# EAGLE design BLE112 Breakout Board v1.1 (EAGLE 6.1)
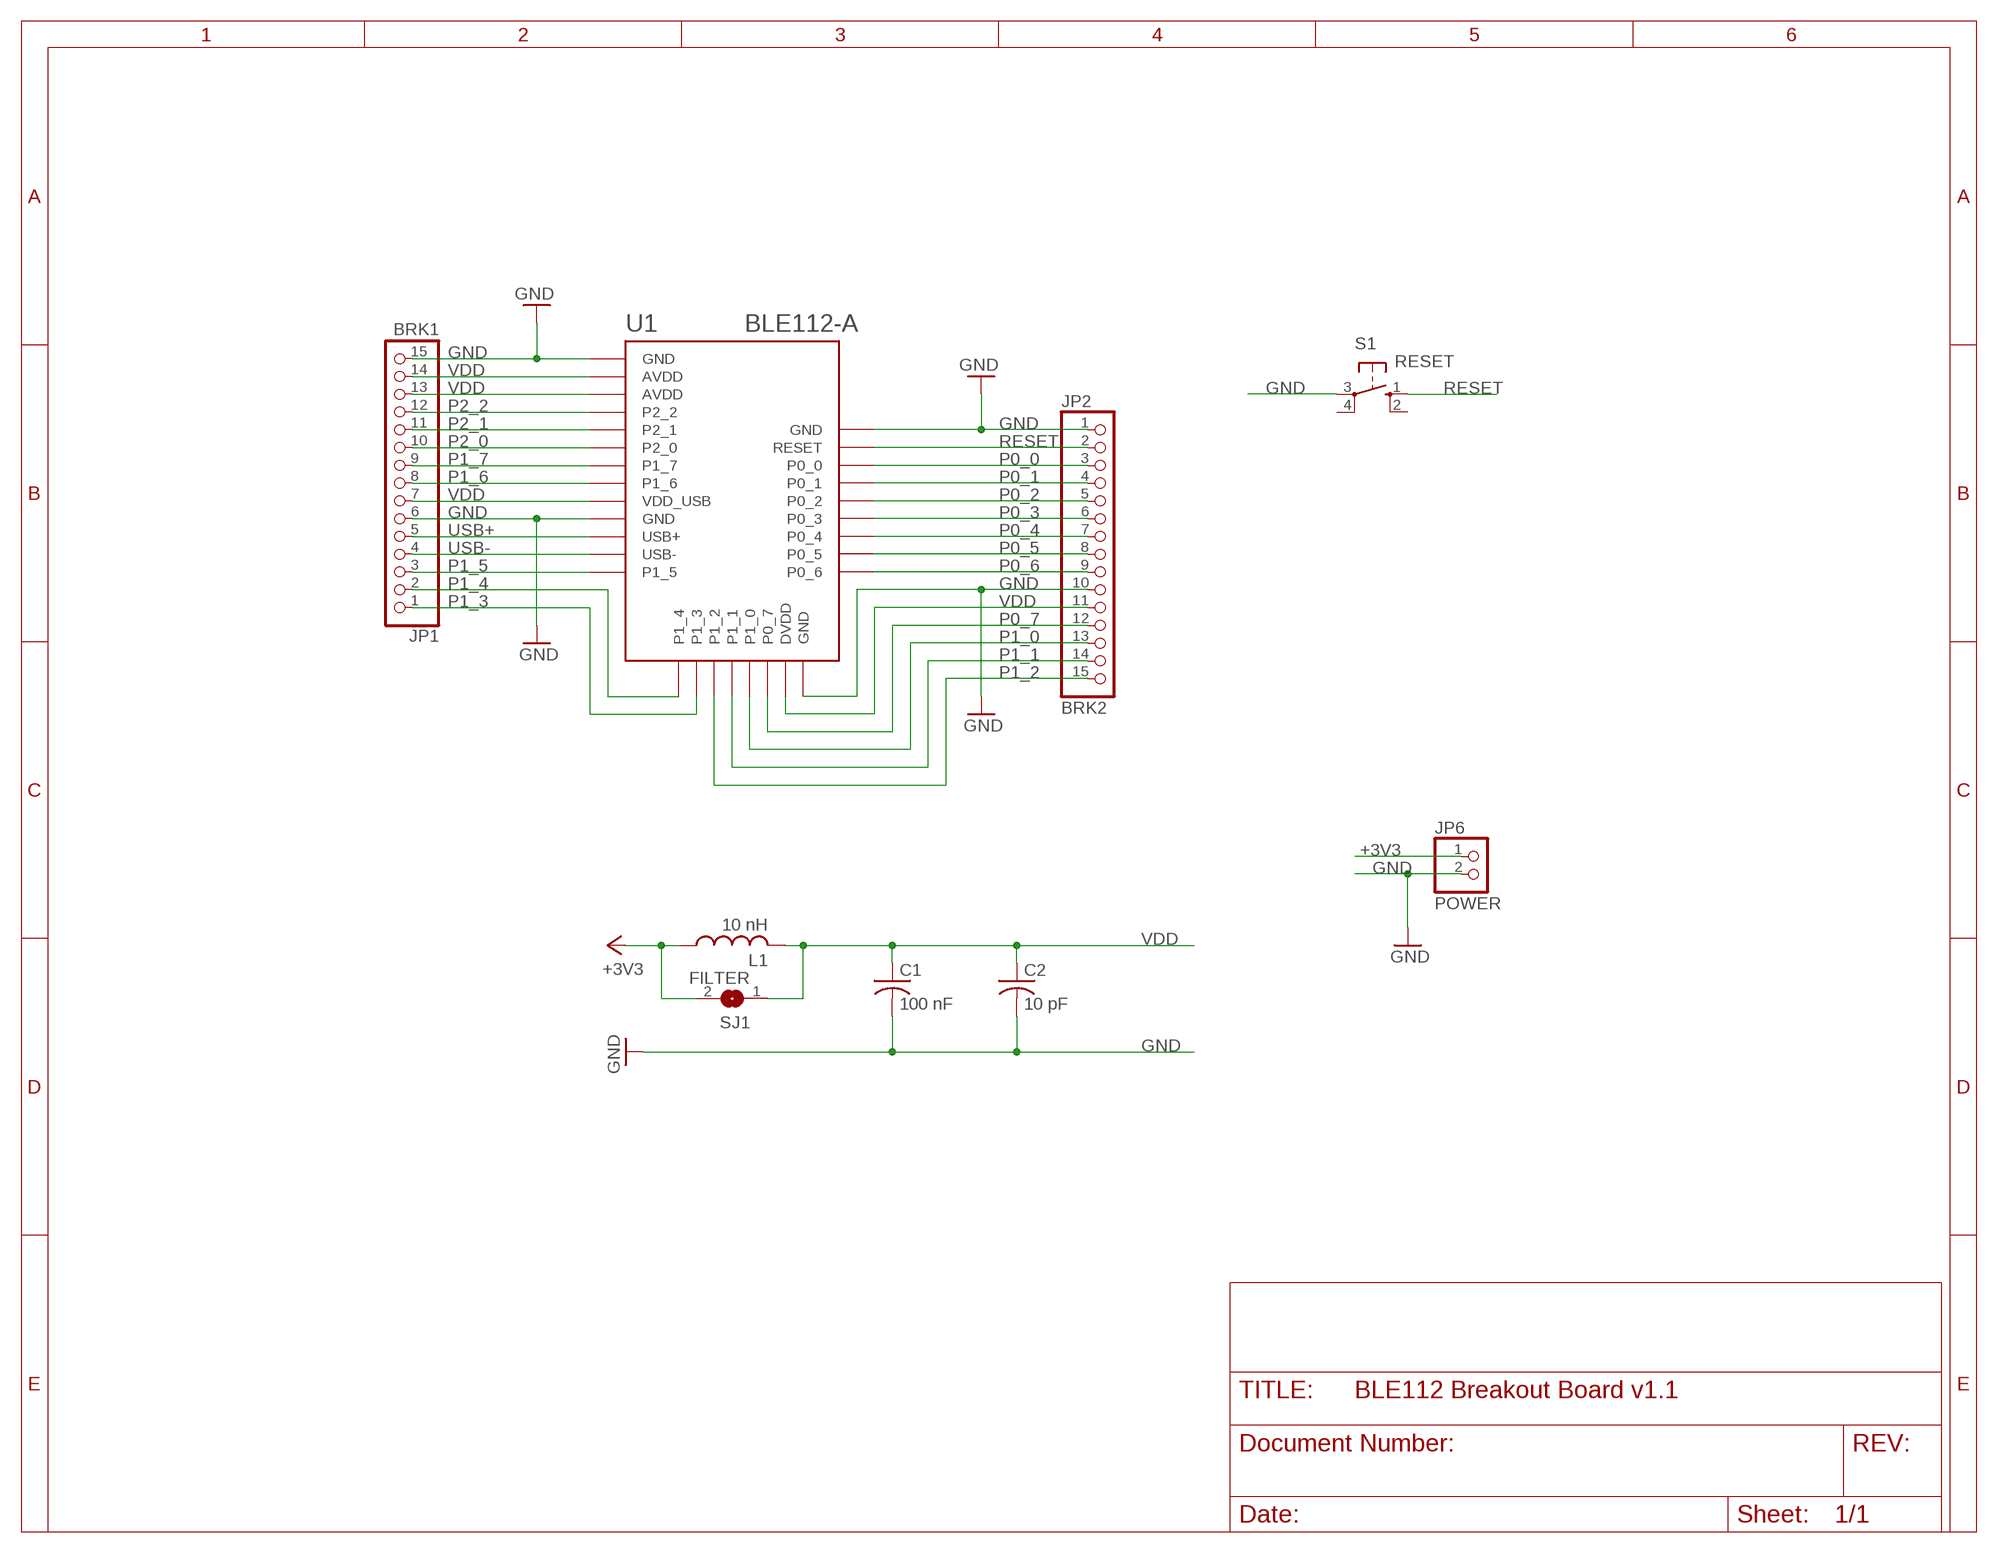
[diagram p0: schematic, sheet 1]

## Parts
C1  100 nF  C-US025-025X050  [C025-025X050]
C2  10 pF  C-US025-025X050  [C025-025X050]
JP1  BRK1  PINHD-1X15  [1X15]
JP2  BRK2  PINHD-1X15  [1X15]
JP6  POWER  PINHD-1X2  [1X02]
L1  10 nH  L-US0204/7  [0204/7]
S1  RESET  10-XX  [B3F-10XX]
SJ1  FILTER  SJ  [SJ]
U1  BLE112-A  BLE112-A-VISUAL  [BLE112-A]

## Nets
+3V3: JP6.1 L1.1 SJ1.2
GND: C1.2 C2.2 JP1.6 JP1.15 JP2.1 JP2.10 JP6.2 S1.3(P) U1.GND1(GND) U1.GND2(GND) U1.GND3(GND) U1.GND4(GND)
P0_0: JP2.3 U1.P0_0
P0_1: JP2.4 U1.P0_1
P0_2: JP2.5 U1.P0_2
P0_3: JP2.6 U1.P0_3
P0_4: JP2.7 U1.P0_4
P0_5: JP2.8 U1.P0_5
P0_6: JP2.9 U1.P0_6
P0_7: JP2.12 U1.P0_7
P1_0: JP2.13 U1.P1_0
P1_1: JP2.14 U1.P1_1
P1_2: JP2.15 U1.P1_2
P1_3: JP1.1 U1.P1_3
P1_4: JP1.2 U1.P1_4
P1_5: JP1.3 U1.P1_5
P1_6: JP1.8 U1.P1_6
P1_7: JP1.9 U1.P1_7
P2_0: JP1.10 U1.P2_0
P2_1: JP1.11 U1.P2_1
P2_2: JP1.12 U1.P2_2
RESET: JP2.2 S1.1(S) U1.RESET
USB+: JP1.5 U1.USB+
USB-: JP1.4 U1.USB-
VDD: C1.1 C2.1 JP1.7 JP1.13 JP1.14 JP2.11 L1.2 SJ1.1 U1.AVDD1(AVDD) U1.AVDD2(AVDD) U1.DVDD U1.VDD_USB
Unconnected: S1.2(S1) S1.4(P1)

## Library data of the parts
C1 C2 = resistor:C-US: CAPACITOR, American symbol
JP1 JP2 = sf-pinhead:PINHD-1X15: PIN HEADER
JP6 = sf-pinhead:PINHD-1X2: PIN HEADER
L1 = resistor:L-US: INDUCTOR, American symbol
S1 = switch-omron:10-XX: OMRON SWITCH; MPN: B3F-1000; OC_FARNELL: 176432; OC_NEWARK: 36M3542
SJ1 = jumper:SJ: SMD solder JUMPER
U1 = sf-bluegiga:BLE112-A-VISUAL: Bluetooth Low Energy single-mode module - Bluetooth 4.0, chip antenna

## Net classes
0 default: width 0.254 mm, drill 0.33 mm, clearance 0.254 mm
1 power: width 0.254 mm, drill 0.33 mm, clearance 0.254 mm

## Board
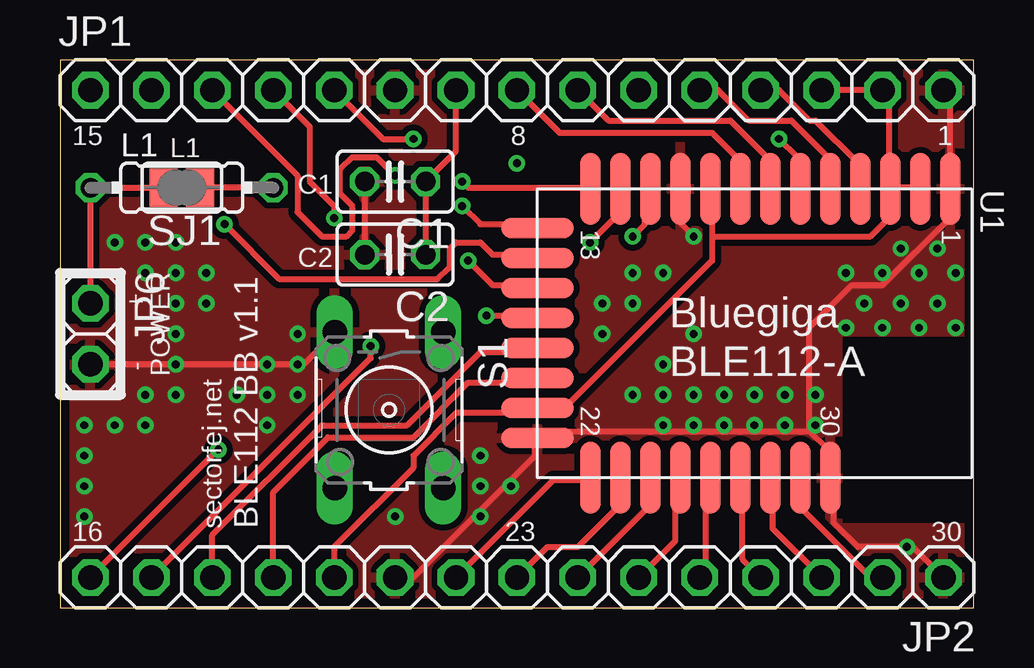
[diagram p1: board, top side]
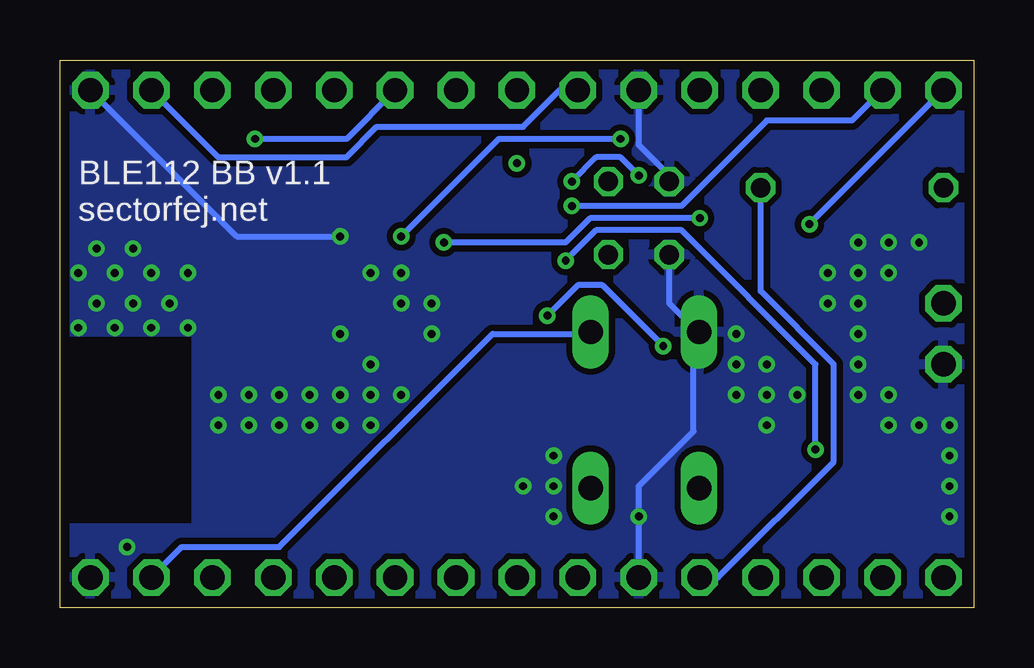
[diagram p2: board, bottom side, seen from below]

Size 38.1 x 22.85 mm. Coordinates in mm from the lower left corner, seen from the top.
Outline: 0,0 38.1,0 38.1,22.85 0,22.85 0,0
Copper layers (1*16): Top 0.0356mm / dielectric 1.5011mm / Bottom 0.0356mm
Design rules: minimum track width 6mil, minimum drill 13mil, track to track 6mil, track to pad 6mil, pad to pad 6mil, via to via 6mil, smd to smd 6mil, copper to edge 15mil, drill to drill 6mil, minimum pad ring 7mil, minimum via ring 7mil, stop-mask expansion 4mil, vias tented up to drill 13mil, thermal gap 10mil
tRestrict: area 32.6,3.6 to 38.1,11.3
bRestrict: area 32.6,3.6 to 38.1,11.3

### Footprints (pad centres in the part's own frame; a part is rotated, then mirrored left to right if it is on the bottom)
C025-025X050 = drill 0.813 octagon: 1 -1.27,0; 2 1.27,0
1X15 = drill 1.016 octagon: 1 -17.78,0; 2 -15.24,0; 3 -12.7,0; 4 -10.16,0; 5 -7.62,0; 6 -5.08,0; 7 -2.54,0; 8 0,0; 9 2.54,0; 10 5.08,0; 11 7.62,0; 12 10.16,0; 13 12.7,0; 14 15.24,0; 15 17.78,0
1X02 = drill 1.016 octagon: 1 -1.27,0; 2 1.27,0
0204/7 = drill 0.813 octagon: 1 -3.81,0; 2 3.81,0
B3F-10XX = drill 1.016 long: 1 -3.251,2.261; 2 3.251,2.261; 3 -3.251,-2.261; 4 3.251,-2.261
SJ = smd 1.168 x 1.6: 1 -0.762,0; 2 0.762,0
BLE112-A = smd 3 x 0.85: AVDD1 -6.05,6.9; AVDD2 -6.05,5.65; GND1 -6.05,8.15; GND2 -6.05,-3.1; GND4 6,3.15; P0_0 6,0.65; P0_1 6,-0.6; P0_2 6,-1.85; P0_3 6,-3.1; P0_4 6,-4.35; P0_5 6,-5.6; P0_6 6,-6.85; P1_5 -6.05,-6.85; P1_6 -6.05,-0.6; P1_7 -6.05,0.65; P2_0 -6.05,1.9; P2_1 -6.05,3.15; P2_2 -6.05,4.4; RESET 6,1.9; USB+ -6.05,-4.35; USB- -6.05,-5.6; VDD_USB -6.05,-1.85 | smd 0.85 x 3: DVDD 3.1,-9.05; GND3 4.35,-9.05; P0_7 1.85,-9.05; P1_0 0.6,-9.05; P1_1 -0.65,-9.05; P1_2 -1.9,-9.05; P1_3 -3.15,-9.05; P1_4 -4.4,-9.05

### Placement (x,y rotation side)
C1  13.97,17.78 180 top
C2  13.97,14.73 180 top
JP1  19.05,21.59 0 top
JP2  19.05,1.27 180 top
JP6  1.27,11.43 270 top
L1  5.08,17.53 0 top
S1  13.72,8.26 270 top
SJ1  5.08,17.53 180 top
U1  28.96,11.43 270 top

### Tracks (layer width: path | path; a pad name or v marks a point on that pad's centre or on a via)
+3V3
  Top 0.254: SJ1.2 L1.1 JP6.1
GND  (via drill 0.33)
  Top 0.254: C1.2 C2.2 | JP6.2 10.16,10.16 11.43,11.43 S1.3 | v26.42,15.49 25.91,16 25.91,17.27 U1.GND2 | JP1.15 37.08,21.34 37.08,17.53 U1.GND1 37.08,17.27 37.08,16.26 34.29,13.46 33.02,13.46 31.24,11.68 31.24,7.37 | JP2.1 35.56,2.54 33.27,2.54 32.26,3.56 32.26,5.33 U1.GND4 32,5.59 32,6.6 31.24,7.37 | JP2.10 14.73,1.27 19.81,6.35 19.81,6.86 U1.GND3 20.07,7.11 20.32,7.37 31.24,7.37
  Bottom 0.254: JP1.6 13.97,19.3 12.7,18.03 C1.2 | C2.2 12.7,12.7 11.68,11.68 S1.3 11.68,11.43 11.68,7.37 13.97,5.08 JP2.10 | v26.42,15.49 30.73,15.49 JP1.15
  other vias: 23.88,8.89 25.15,8.89 26.42,8.89 27.69,8.89 32.77,11.68 33.53,12.7 34.29,11.68 35.05,12.7 36.58,12.7 35.81,11.68 37.34,11.68 37.34,13.97 35.81,13.97 34.29,13.97 32.77,13.97 36.58,14.99 35.05,14.99 23.88,12.7 22.61,12.7 23.88,13.97 25.15,13.97 22.61,11.43 25.15,10.16 26.42,11.43 28.96,8.89 30.23,8.89 28.96,7.62 27.69,7.62 26.42,7.62 25.15,7.62 30.23,7.62 31.5,7.62 31.5,8.89 35.31,2.54 1.02,5.08 1.02,6.35 1.02,7.62 2.29,15.24 3.56,15.24 4.83,15.24 6.1,13.97 4.83,13.97 6.1,12.7 4.83,12.7 4.83,11.43 4.83,10.16 3.56,13.97 3.56,8.89 4.83,8.89 2.29,7.62 3.56,7.62 1.02,3.81 17.53,6.35 17.53,5.08 18.8,5.08 17.53,3.81 13.97,3.81 7.37,8.89 8.64,8.89 8.64,10.16 9.91,11.43 9.91,10.16 9.91,8.89 8.64,7.62
  pour Bottom: 0,22.86 38.1,22.86 38.1,0 0,0
  pour Top: 0,22.86 38.1,22.86 38.1,0 0,0
N$1  (via drill 0.33)
  other vias: 19.05,18.54
P0_0
  Top 0.254: JP2.3 29.72,3.3 29.72,5.33 U1.P0_0
P0_1
  Top 0.254: JP2.4 28.45,2.03 28.45,5.33 U1.P0_1
P0_2
  Top 0.254: JP2.5 26.92,1.52 26.92,5.33 U1.P0_2
P0_3
  Top 0.254: JP2.6 25.65,2.79 25.65,5.33 U1.P0_3
P0_4
  Top 0.254: JP2.7 24.38,4.06 24.38,5.33 U1.P0_4
P0_5
  Top 0.254: JP2.8 20.32,2.54 21.59,2.54 23.11,4.06 23.11,5.33 U1.P0_5
P0_6
  Top 0.254: JP2.9 20.57,5.33 22.1,5.33 U1.P0_6
P0_7
  Top 0.254: JP2.12 8.89,4.83 11.18,7.11 14.73,7.11 17.02,9.4 19.81,9.4 U1.P0_7
P1_0
  Top 0.254: JP2.13 6.35,3.05 10.92,7.62 14.48,7.62 17.53,10.67 19.81,10.67 U1.P1_0
P1_1  (via drill 0.33)
  Top 0.254: v17.78,12.19 19.81,12.19 U1.P1_1 | v12.95,10.92 12.95,10.41 JP2.14
  Bottom 0.254: v17.78,12.19 16.51,13.46 15.49,13.46 v12.95,10.92
P1_2  (via drill 0.33)
  Top 0.254: v17.02,14.48 18.03,13.46 19.81,13.46 U1.P1_2 | JP2.15 v6.6,6.6
  Bottom 0.254: v17.02,14.48 15.75,15.75 12.19,15.75 6.6,10.16 v6.6,6.6
P1_3  (via drill 0.33)
  Top 0.254: v6.86,16 9.14,13.72 15.75,13.72 16.26,14.22 16.26,14.99 16.51,15.24 17.53,15.24 18.03,14.73 19.81,14.73 U1.P1_3
  Bottom 0.254: JP1.1 v6.86,16
P1_4  (via drill 0.33)
  Top 0.254: v16.76,16.76 17.53,16 19.81,16 U1.P1_4
  Bottom 0.254: v16.76,16.76 12.19,16.76 8.64,20.32 5.08,20.32 JP1.2
P1_5  (via drill 0.33)
  Top 0.254: v16.76,17.78 17.02,17.53 22.1,17.53 U1.P1_5 | v13.97,18.03 13.21,18.8 12.19,18.8 11.68,18.29 11.68,17.27 12.19,16.76 12.19,15.75 11.94,15.49 10.92,15.49 9.91,16.51 9.91,18.03 JP1.3
  Bottom 0.254: v16.76,17.78 15.75,18.8 14.73,18.8 v13.97,18.03
P1_6
  Top 0.254: JP1.8 20.83,19.81 27.18,19.81 28.19,18.8 28.19,17.53 U1.P1_6
P1_7
  Top 0.254: JP1.9 22.86,20.32 27.94,20.32 29.46,18.8 29.46,17.53 U1.P1_7
P2_0  (via drill 0.33)
  Top 0.254: v29.97,19.56 30.73,18.8 30.73,17.53 U1.P2_0
  Bottom 0.254: v29.97,19.56 26.16,19.56 JP1.10
P2_1
  Top 0.254: JP1.11 27.43,21.59 28.7,20.32 30.48,20.32 32,18.8 32,17.53 U1.P2_1
P2_2
  Top 0.254: JP1.12 29.97,21.59 31.24,20.32 31.5,20.32 33.27,18.54 33.27,17.53 U1.P2_2
RESET
  Top 0.254: JP2.2 33.78,1.27 30.99,4.06 30.99,5.33 U1.RESET
  Bottom 0.254: JP2.2 33.02,2.54 28.96,2.54 20.07,11.43 16,11.43 S1.1
USB+  (via drill 0.33)
  Top 0.254: v23.88,15.49 24.38,16 24.38,17.27 U1.USB+ | v14.73,19.56 13.46,19.56 JP1.5
  Bottom 0.254: v23.88,15.49 19.81,19.56 v14.73,19.56
USB-  (via drill 0.33)
  Top 0.254: v22.1,15.24 23.11,16.26 23.11,17.27 U1.USB- | v11.43,16.26 11.43,16.76 10.41,17.78 10.41,20.07 JP1.4
  Bottom 0.254: v22.1,15.24 17.02,15.24 16,16.26 v11.43,16.26
VDD
  Top 0.254: C2.1 C1.1 16.51,19.05 JP1.7 | U1.AVDD2 34.8,17.53 35.81,17.53 U1.AVDD1 | JP1.13 JP1.14 34.54,21.34 34.54,17.53 U1.AVDD2 | L1.2 SJ1.1 | 27.18,15.49 27.18,17.27 U1.VDD_USB | 27.18,15.49 27.18,14.48 21.08,8.38 20.07,8.38 U1.DVDD 19.81,8.13 16.51,8.13 14.73,6.35 14.73,5.84 11.43,2.54 JP2.11 | 27.18,15.49 33.78,15.49 34.54,16.26 34.54,17.27 U1.AVDD2
  Bottom 0.254: JP1.7 17.27,21.59 18.8,20.07 24.89,20.07 26.16,18.8 31.5,18.8 JP1.14 | L1.2 8.89,13.21 5.84,10.16 5.84,6.1 10.67,1.27 JP2.11

### Text on the board
tPlace: 15 | L1 | 8 | 1 | C1 | C2 | + | Bluegiga | - | POWER | BLE112-A | 16 | sectorfej.net | BLE112 BB v1.1 | 23 | 30
bPlace: BLE112 BB v1.1 | sectorfej.net